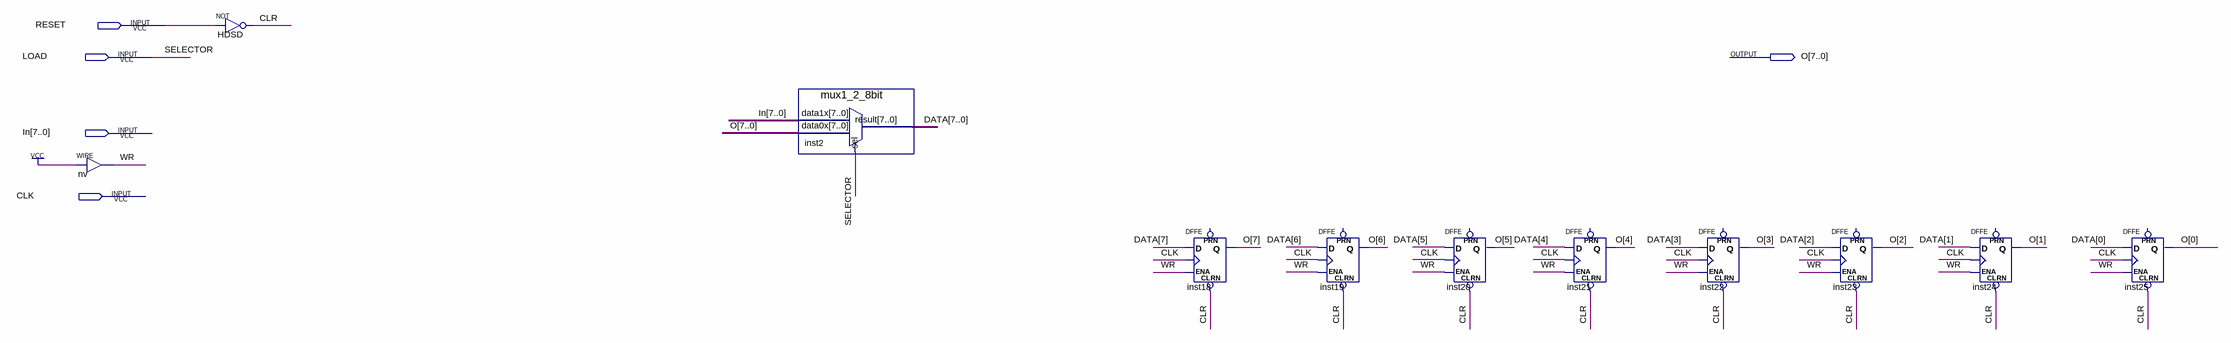
[diagram p0: schematic sheet]
// Quartus schematic REG_8withLD.bdf as structural Verilog: 11 symbols, 5 pins
module REG_8withLD (
  input  RESET,
  input  LOAD,
  input  [7:0] In,
  input  CLK,
  output [7:0] O
);

  wire CLR, WR;
  wire [7:0] DATA;

  assign WR = 1'b1;  // WIRE nv
  not HDSD (CLR, RESET);
  mux1_2_8bit inst2 (.data1x(In), .data0x(O), .sel(LOAD), .result(DATA));
  DFFE inst18 (.CLRN(CLR), .D(DATA[7]), .CLK(CLK), .ENA(WR), .Q(O[7]));  // open: PRN
  DFFE inst19 (.CLRN(CLR), .D(DATA[6]), .CLK(CLK), .ENA(WR), .Q(O[6]));  // open: PRN
  DFFE inst20 (.CLRN(CLR), .D(DATA[5]), .CLK(CLK), .ENA(WR), .Q(O[5]));  // open: PRN
  DFFE inst21 (.CLRN(CLR), .D(DATA[4]), .CLK(CLK), .ENA(WR), .Q(O[4]));  // open: PRN
  DFFE inst22 (.CLRN(CLR), .D(DATA[3]), .CLK(CLK), .ENA(WR), .Q(O[3]));  // open: PRN
  DFFE inst23 (.CLRN(CLR), .D(DATA[2]), .CLK(CLK), .ENA(WR), .Q(O[2]));  // open: PRN
  DFFE inst24 (.CLRN(CLR), .D(DATA[1]), .CLK(CLK), .ENA(WR), .Q(O[1]));  // open: PRN
  DFFE inst25 (.CLRN(CLR), .D(DATA[0]), .CLK(CLK), .ENA(WR), .Q(O[0]));  // open: PRN

  // Other names for the same wires on the sheet: SELECTOR = LOAD
endmodule
